# Altium project TEXAS.PrjPCB
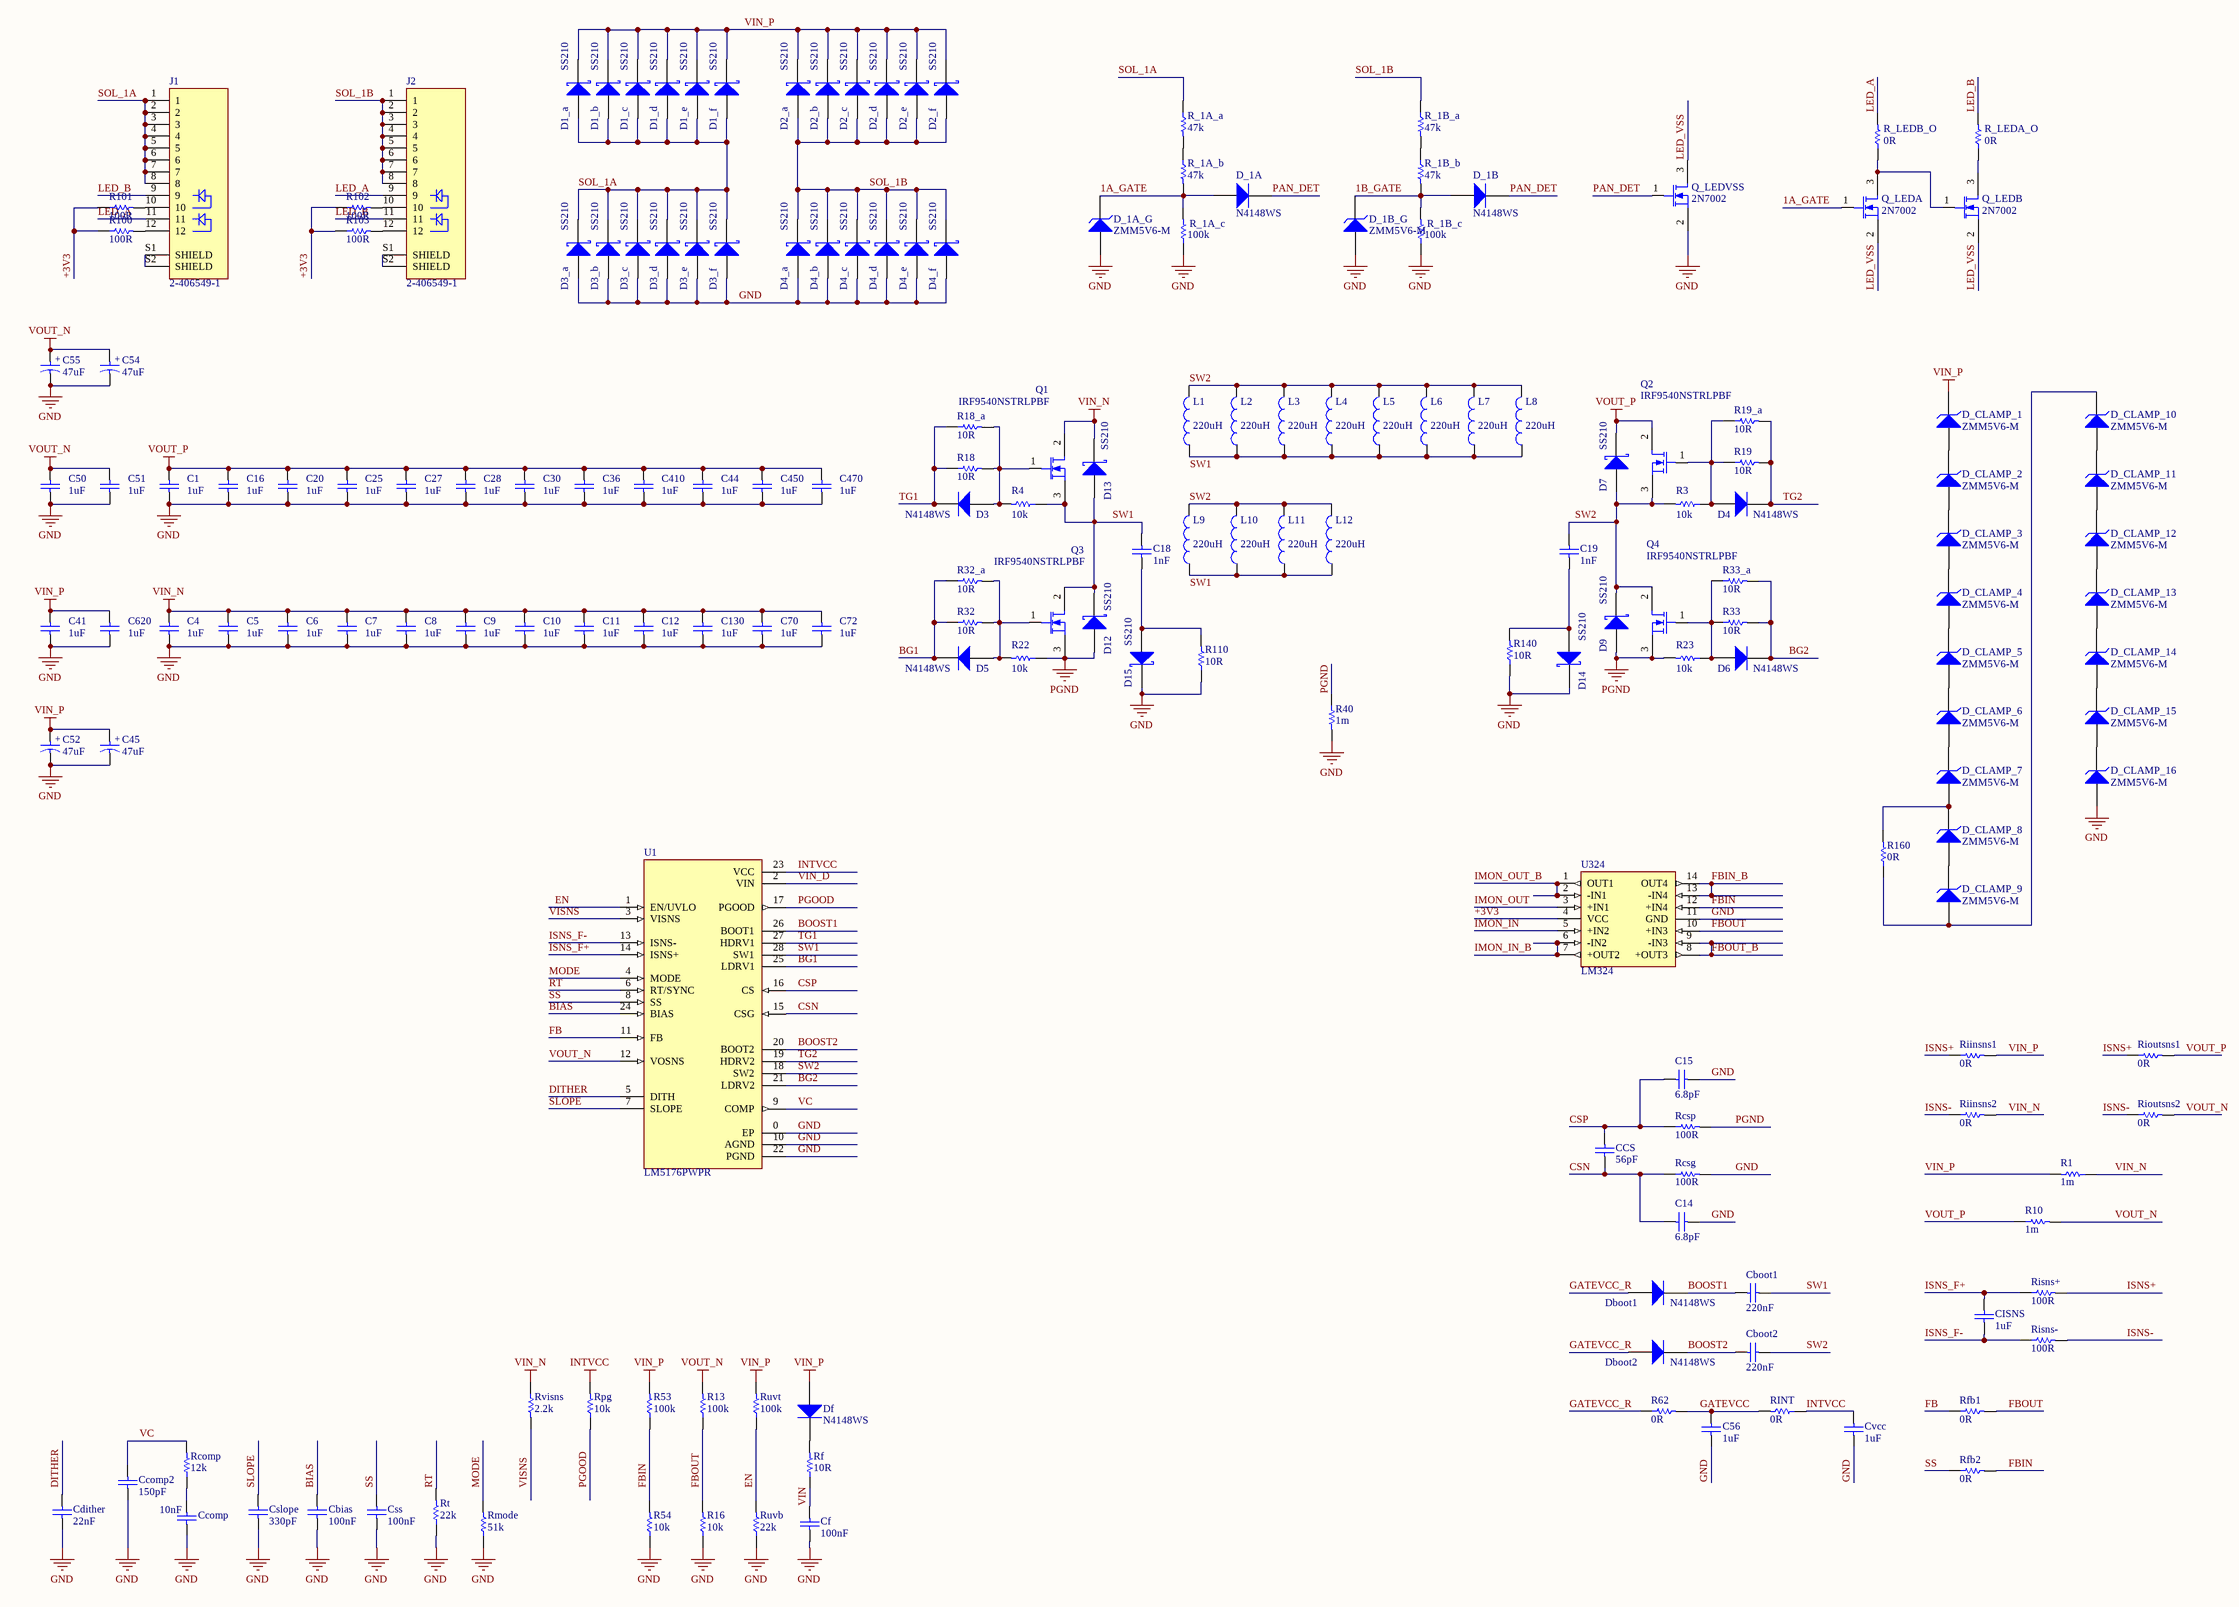
[diagram p0: SM3320-BATT-EV.SchDoc]
PCB_CopperRev: 001; PCB_MinorRev: -001 REV A; PCB_SilkRev: REV A; PRJ_BasePN: 600556; PRJ_Customer: National Semiconductor; PRJ_Title: SM3320-BATT-EV; SCH_Rev: X1; TechSupport: http://www.national.com/support
1 sheet, 183 parts. Net scope: global (net labels, ports and power ports of the same name join across sheets).
Board file: SM3320-BATT-EV.PcbDoc

## Sheet SM3320-BATT-EV.SchDoc: ChangeMe
size C; Date: Not shown in title block; ApprovedBy: Not shown in title block; CheckedBy: Not shown in title block; Author: Not shown in title block; CompanyName: Not shown in title block; DrawnBy: Not shown in title block; Engineer: Not shown in title block; Organization: Not shown in title block; Address1: Not shown in title block; Address2: Not shown in title block; Address3: Not shown in title block; Address4: Not shown in title block; DocumentNumber: 1; Revision: Use project parameter SCH_Rev; SheetNumber: 1; SheetTotal: 1; PageSetup: Record=PageOptions|CenterHorizontal=True|CenterVertical=True|PrintScale=0.85|XCorrection=0.00|YCorrection=0.00|PrintKind=2|BorderSize=5000000|LeftOffset=0|BottomOffset=0|Orientation=2|PaperLength=1000|PaperWidth=1000|Scale=100|PaperSource=15|PrintQuality=600|MediaType=1|DitherType=10|PaperKind=11x17|PrintScaleMode=0; CurrentTime: Not shown in title block; CurrentDate: Not shown in title block; Time: Not shown in title block; DocumentFullPathAndName: Not shown in title block; DocumentName: Not shown in title block; ModifiedDate: Not shown in title block; ImagePath: Not shown in title block

### Parts
C1  value 1uF  [C_1206]  (hidden comment: 1206B105K101NT)
C4  value 1uF  [C_1206]  (hidden comment: 1206B105K101NT)
C5  value 1uF  [C_1206]  (hidden comment: 1206B105K101NT)
C6  value 1uF  [C_1206]  (hidden comment: 1206B105K101NT)
C7  value 1uF  [C_1206]  (hidden comment: 1206B105K101NT)
C8  value 1uF  [C_1206]  (hidden comment: 1206B105K101NT)
C9  value 1uF  [C_1206]  (hidden comment: 1206B105K101NT)
C10  value 1uF  [C_1206]  (hidden comment: 1206B105K101NT)
C11  value 1uF  [C_1206]  (hidden comment: 1206B105K101NT)
C12  value 1uF  [C_1206]  (hidden comment: 1206B105K101NT)
C14  value 6.8pF  [C_0402]  (hidden comment: 0402CG6R8C500NT)
C15  value 6.8pF  [C_0402]  (hidden comment: 0402CG6R8C500NT)
C16  value 1uF  [C_1206]  (hidden comment: 1206B105K101NT)
C18  value 1nF  [C_1206]  (hidden comment: 1206B102K202NT)
C19  value 1nF  [C_1206]  (hidden comment: 1206B102K202NT)
C20  value 1uF  [C_1206]  (hidden comment: 1206B105K101NT)
C25  value 1uF  [C_1206]  (hidden comment: 1206B105K101NT)
C27  value 1uF  [C_1206]  (hidden comment: 1206B105K101NT)
C28  value 1uF  [C_1206]  (hidden comment: 1206B105K101NT)
C30  value 1uF  [C_1206]  (hidden comment: 1206B105K101NT)
C36  value 1uF  [C_1206]  (hidden comment: 1206B105K101NT)
C41  value 1uF  [C_1206]  (hidden comment: 1206B105K101NT)
C44  value 1uF  [C_1206]  (hidden comment: 1206B105K101NT)
C45  value 47uF  [C_CAN_1010]  (hidden comment: VZH470M2ATR-1010)
C50  value 1uF  [C_1206]  (hidden comment: 1206B105K101NT)
C51  value 1uF  [C_1206]  (hidden comment: 1206B105K101NT)
C52  value 47uF  [C_CAN_1010]  (hidden comment: VZH470M2ATR-1010)
C54  value 47uF  [C_CAN_1010]  (hidden comment: VZH470M2ATR-1010)
C55  value 47uF  [C_CAN_1010]  (hidden comment: VZH470M2ATR-1010)
C56  value 1uF  [C_0402]  (hidden comment: CL05A105KA5NQNC)
C70  value 1uF  [C_1206]  (hidden comment: 1206B105K101NT)
C72  value 1uF  [C_1206]  (hidden comment: 1206B105K101NT)
C130  value 1uF  [C_1206]  (hidden comment: 1206B105K101NT)
C410  value 1uF  [C_1206]  (hidden comment: 1206B105K101NT)
C450  value 1uF  [C_1206]  (hidden comment: 1206B105K101NT)
C470  value 1uF  [C_1206]  (hidden comment: 1206B105K101NT)
C620  value 1uF  [C_1206]  (hidden comment: 1206B105K101NT)
Cbias  value 100nF  [C_0603]  (hidden comment: CC0603KRX7R9BB104)
Cboot1  value 220nF  [C_0402]  (hidden comment: CL05B224KO5NNNC)
Cboot2  value 220nF  [C_0402]  (hidden comment: CL05B224KO5NNNC)
Ccomp  value 10nF  [C_0402]  (hidden comment: CL05B103KB5NNNC)
Ccomp2  value 150pF  [C_0402]  (hidden comment: 0402B151K500NT)
CCS  value 56pF  [C_0402]  (hidden comment: 0402CG560J500NT)
Cdither  value 22nF  [C_0402]  (hidden comment: 0402B223K500NT)
Cf  value 100nF  [C_0603]  (hidden comment: CC0603KRX7R9BB104)
CISNS  value 1uF  [C_0402]  (hidden comment: CL05A105KA5NQNC)
Cslope  value 330pF  [C_0603]  (hidden comment: CL10C331JB8NNNC)
Css  value 100nF  [C_0402]  (hidden comment: CL05B104KO5NNNC)
Cvcc  value 1uF  [C_0402]  (hidden comment: CL05A105KA5NQNC)
D1_a  SS210  [DO-214AC]
D1_b  SS210  [DO-214AC]
D1_c  SS210  [DO-214AC]
D1_d  SS210  [DO-214AC]
D1_e  SS210  [DO-214AC]
D1_f  SS210  [DO-214AC]
D2_a  SS210  [DO-214AC]
D2_b  SS210  [DO-214AC]
D2_c  SS210  [DO-214AC]
D2_d  SS210  [DO-214AC]
D2_e  SS210  [DO-214AC]
D2_f  SS210  [DO-214AC]
D3  N4148WS  [SOD-323]
D3_a  SS210  [DO-214AC]
D3_b  SS210  [DO-214AC]
D3_c  SS210  [DO-214AC]
D3_d  SS210  [DO-214AC]
D3_e  SS210  [DO-214AC]
D3_f  SS210  [DO-214AC]
D4  N4148WS  [SOD-323]
D4_a  SS210  [DO-214AC]
D4_b  SS210  [DO-214AC]
D4_c  SS210  [DO-214AC]
D4_d  SS210  [DO-214AC]
D4_e  SS210  [DO-214AC]
D4_f  SS210  [DO-214AC]
D5  N4148WS  [SOD-323]
D6  N4148WS  [SOD-323]
D7  SS210  [DO-214AC]
D9  SS210  [DO-214AC]
D12  SS210  [DO-214AC]
D13  SS210  [DO-214AC]
D14  SS210  [DO-214AC]
D15  SS210  [DO-214AC]
D_1A  N4148WS  [SOD-323]
D_1A_G  ZMM5V6-M  [DO-213AA]
D_1B  N4148WS  [SOD-323]
D_1B_G  ZMM5V6-M  [DO-213AA]
D_CLAMP_1  ZMM5V6-M  [DO-213AA]
D_CLAMP_2  ZMM5V6-M  [DO-213AA]
D_CLAMP_3  ZMM5V6-M  [DO-213AA]
D_CLAMP_4  ZMM5V6-M  [DO-213AA]
D_CLAMP_5  ZMM5V6-M  [DO-213AA]
D_CLAMP_6  ZMM5V6-M  [DO-213AA]
D_CLAMP_7  ZMM5V6-M  [DO-213AA]
D_CLAMP_8  ZMM5V6-M  [DO-213AA]
D_CLAMP_9  ZMM5V6-M  [DO-213AA]
D_CLAMP_10  ZMM5V6-M  [DO-213AA]
D_CLAMP_11  ZMM5V6-M  [DO-213AA]
D_CLAMP_12  ZMM5V6-M  [DO-213AA]
D_CLAMP_13  ZMM5V6-M  [DO-213AA]
D_CLAMP_14  ZMM5V6-M  [DO-213AA]
D_CLAMP_15  ZMM5V6-M  [DO-213AA]
D_CLAMP_16  ZMM5V6-M  [DO-213AA]
Dboot1  N4148WS  [SOD-323]
Dboot2  N4148WS  [SOD-323]
Df  N4148WS  [SOD-323]
J1  2-406549-1  [TE_2-406549-1]
J2  2-406549-1  [TE_2-406549-1]
L1  value 220uH  [SRR1260]  (hidden comment: SWRB1207S-221MT)
L2  value 220uH  [SRR1260]  (hidden comment: SWRB1207S-221MT)
L3  value 220uH  [SRR1260]  (hidden comment: SWRB1207S-221MT)
L4  value 220uH  [SRR1260]  (hidden comment: SWRB1207S-221MT)
L5  value 220uH  [SRR1260]  (hidden comment: SWRB1207S-221MT)
L6  value 220uH  [SRR1260]  (hidden comment: SWRB1207S-221MT)
L7  value 220uH  [SRR1260]  (hidden comment: SWRB1207S-221MT)
L8  value 220uH  [SRR1260]  (hidden comment: SWRB1207S-221MT)
L9  value 220uH  [SRR1260]  (hidden comment: SWRB1207S-221MT)
L10  value 220uH  [SRR1260]  (hidden comment: SWRB1207S-221MT)
L11  value 220uH  [SRR1260]  (hidden comment: SWRB1207S-221MT)
L12  value 220uH  [SRR1260]  (hidden comment: SWRB1207S-221MT)
Q1  IRF9540NSTRLPBF  [TO-263-3]
Q2  IRF9540NSTRLPBF  [TO-263-3]
Q3  IRF9540NSTRLPBF  [TO-263-3]
Q4  IRF9540NSTRLPBF  [TO-263-3]
Q_LEDA  2N7002  [TO-236AB]
Q_LEDB  2N7002  [TO-236AB]
Q_LEDVSS  2N7002  [TO-236AB]
R1  1m  [R_2512]
R3  value 10k  [R_0402]  (hidden comment: 0402WGF1002TCE)
R4  value 10k  [R_0402]  (hidden comment: 0402WGF1002TCE)
R10  1m  [R_2512]
R13  value 100k  [R_0603]  (hidden comment: 0603WAF100KT5E)
R16  value 10k  [R_0603]  (hidden comment: 0603WAF1002T5E)
R18  value 10R  [R_0402]  (hidden comment: 0402WGF100JTCE)
R18_a  value 10R  [R_0402]  (hidden comment: 0402WGF100JTCE)
R19  value 10R  [R_0402]  (hidden comment: 0402WGF100JTCE)
R19_a  value 10R  [R_0402]  (hidden comment: 0402WGF100JTCE)
R22  value 10k  [R_0402]  (hidden comment: 0402WGF1002TCE)
R23  value 10k  [R_0402]  (hidden comment: 0402WGF1002TCE)
R32  value 10R  [R_0402]  (hidden comment: 0402WGF100JTCE)
R32_a  value 10R  [R_0402]  (hidden comment: 0402WGF100JTCE)
R33  value 10R  [R_0402]  (hidden comment: 0402WGF100JTCE)
R33_a  value 10R  [R_0402]  (hidden comment: 0402WGF100JTCE)
R40  1m  [R_2512]
R53  value 100k  [R_0603]  (hidden comment: 0603WAF100KT5E)
R54  value 10k  [R_0603]  (hidden comment: 0603WAF1002T5E)
R62  value 0R  [R_0402]  (hidden comment: 0402WGF0000TCE)
R100  value 100R  [R_0402]  (hidden comment: 0402WGF1000TCE)
R101  value 100R  [R_0402]  (hidden comment: 0402WGF1000TCE)
R102  value 100R  [R_0402]  (hidden comment: 0402WGF1000TCE)
R103  value 100R  [R_0402]  (hidden comment: 0402WGF1000TCE)
R110  value 10R  [R_1206]  (hidden comment: 1206W4F100JT5E)
R140  value 10R  [R_1206]  (hidden comment: 1206W4F100JT5E)
R160  value 0R  [R_0402]  (hidden comment: 0402WGF0000TCE)
R_1A_a  value 47k  [R_0402]  (hidden comment: 0402WGF4702TCE)
R_1A_b  value 47k  [R_0402]  (hidden comment: 0402WGF4702TCE)
R_1A_c  value 100k  [R_0402]  (hidden comment: 0402WGF1003TCE)
R_1B_a  value 47k  [R_0402]  (hidden comment: 0402WGF4702TCE)
R_1B_b  value 47k  [R_0402]  (hidden comment: 0402WGF4702TCE)
R_1B_c  value 100k  [R_0402]  (hidden comment: 0402WGF1003TCE)
R_LEDA_O  value 0R  [R_0402]  (hidden comment: 0402WGF0000TCE)
R_LEDB_O  value 0R  [R_0402]  (hidden comment: 0402WGF0000TCE)
Rcomp  value 12k  [R_0402]  (hidden comment: 0402WGF1202TCE)
Rcsg  value 100R  [R_0402]  (hidden comment: 0402WGF1000TCE)
Rcsp  value 100R  [R_0402]  (hidden comment: 0402WGF1000TCE)
Rf  value 10R  [R_0402]  (hidden comment: 0402WGF100JTCE)
Rfb1  value 0R  [R_0402]  (hidden comment: 0402WGF0000TCE)
Rfb2  value 0R  [R_0402]  (hidden comment: 0402WGF0000TCE)
Riinsns1  value 0R  [R_0402]  (hidden comment: 0402WGF0000TCE)
Riinsns2  value 0R  [R_0402]  (hidden comment: 0402WGF0000TCE)
RINT  value 0R  [R_0402]  (hidden comment: 0402WGF0000TCE)
Rioutsns1  value 0R  [R_0402]  (hidden comment: 0402WGF0000TCE)
Rioutsns2  value 0R  [R_0402]  (hidden comment: 0402WGF0000TCE)
Risns+  value 100R  [R_0402]  (hidden comment: 0402WGF1000TCE)
Risns-  value 100R  [R_0402]  (hidden comment: 0402WGF1000TCE)
Rmode  value 51k  [R_0402]  (hidden comment: 0402WGF5102TCE)
Rpg  value 10k  [R_0402]  (hidden comment: 0402WGF1002TCE)
Rt  value 22k  [R_0402]  (hidden comment: 0402WGF2202TCE)
Ruvb  value 22k  [R_0402]  (hidden comment: 0402WGF2202TCE)
Ruvt  value 100k  [R_0603]  (hidden comment: 0603WAF100KT5E)
Rvisns  value 2.2k  [R_0402]  (hidden comment: 0402WGF2201TCE)
U1  LM5176PWPR  [TSSOP-28-EP-P0.65MM-W4.4MM]
U324  LM324  [SOIC-14-P1.27-W3.5]

### Nets
GND: C1.1 C4.1 C5.1 C6.1 C7.1 C8.1 C9.1 C10.1 C11.1 C12.1 C14.2 C15.2 C16.1 C20.1 C25.1 C27.1 C28.1 C30.1 C36.1 C41.1 C44.1 C45.1 C50.1 C51.1 C52.1 C54.1 C55.1 C56.1 C70.1 C72.1 C130.1 C410.1 C450.1 C470.1 C620.1 Cbias.1 Ccomp.1 Ccomp2.1 Cdither.1 Cf.1 Cslope.1 Css.1 Cvcc.1 D3_a.2(A) D3_b.2(A) D3_c.2(A) D3_d.2(A) D3_e.2(A) D3_f.2(A) D4_a.2(A) D4_b.2(A) D4_c.2(A) D4_d.2(A) D4_e.2(A) D4_f.2(A) D14.1(K) D15.1(K) D_1A_G.2(A) D_1B_G.2(A) D_CLAMP_16.2(A) Q_LEDVSS.2(S) R16.1 R40.2 R54.1 R110.1 R140.1 R_1A_c.1 R_1B_c.1 Rcsg.2 Rmode.1 Rt.1 Ruvb.1 U1.0(EP) U1.10(AGND) U1.22(PGND) U324.11(GND)
INTVCC: Cvcc.2 RINT.1 Rpg.2 U1.23(VCC)
PGND: D9.2(A) D12.2(A) Q3.3(S) Q4.3(S) R22.1 R23.2 R40.1 Rcsp.2
VIN_N: C4.2 C5.2 C6.2 C7.2 C8.2 C9.2 C10.2 C11.2 C12.2 C70.2 C72.2 C130.2 D13.1(K) Q1.2(D) R1.1 Riinsns2.2 Rvisns.1
VIN_P: C41.2 C45.2 C52.2 C620.2 D1_a.1(K) D1_b.1(K) D1_c.1(K) D1_d.1(K) D1_e.1(K) D1_f.1(K) D2_a.1(K) D2_b.1(K) D2_c.1(K) D2_d.1(K) D2_e.1(K) D2_f.1(K) D_CLAMP_1.1(K) Df.2(A) R1.2 R53.2 Riinsns1.2 Ruvt.2
VOUT_N: C50.2 C51.2 C54.2 C55.2 R10.2 R13.2 Rioutsns2.2 U1.12(VOSNS)
VOUT_P: C1.2 C16.2 C20.2 C25.2 C27.2 C28.2 C30.2 C36.2 C44.2 C410.2 C450.2 C470.2 D7.1(K) Q2.2(D) R10.1 Rioutsns1.2
1A_GATE: D_1A.2(A) D_1A_G.1(K) Q_LEDA.1(G) R_1A_b.2 R_1A_c.2
1B_GATE: D_1B.2(A) D_1B_G.1(K) R_1B_b.2 R_1B_c.2
+3V3: R100.1 R101.1 R102.1 R103.1 U324.4(VCC)
BG1: D5.1(K) R32.1 R32_a.1 U1.25(LDRV1)
BG2: D6.1(K) R33.2 R33_a.2 U1.21(LDRV2)
BIAS: Cbias.2 U1.24(BIAS)
BOOST1: Cboot1.2 Dboot1.1(K) U1.26(BOOT1)
BOOST2: Cboot2.2 Dboot2.1(K) U1.20(BOOT2)
CSN: C14.1 CCS.1 Rcsg.1 U1.15(CSG)
CSP: C15.1 CCS.2 Rcsp.1 U1.16(CS)
DITHER: Cdither.2 U1.5(DITH)
EN: Ruvb.2 Ruvt.1 U1.1(EN/UVLO)
FB: Rfb1.1 U1.11(FB)
FBIN: R53.1 R54.2 Rfb2.2 U324.12(+IN4)
FBIN_B: U324.13(-IN4) U324.14(OUT4)
FBOUT: R13.1 R16.2 Rfb1.2 U324.10(+IN3)
FBOUT_B: U324.8(+OUT3) U324.9(-IN3)
GATEVCC: C56.2 R62.2 RINT.2
GATEVCC_R: Dboot1.2(A) Dboot2.2(A) R62.1
IMON_IN: U324.5(+IN2)
IMON_IN_B: U324.6(-IN2) U324.7(+OUT2)
IMON_OUT: U324.3(+IN1)
IMON_OUT_B: U324.1(OUT1) U324.2(-IN1)
ISNS+: Riinsns1.1 Rioutsns1.1 Risns+.2
ISNS-: Riinsns2.1 Rioutsns2.1 Risns-.2
ISNS_F+: CISNS.2 Risns+.1 U1.14(ISNS+)
ISNS_F-: CISNS.1 Risns-.1 U1.13(ISNS-)
LED_A: J1.11 J2.9 R_LEDB_O.2
LED_B: J1.9 J2.11 R_LEDA_O.2
LED_VSS: Q_LEDA.2(S) Q_LEDB.2(S) Q_LEDVSS.3(D)
MODE: Rmode.2 U1.4(MODE)
PAN_DET: D_1A.1(K) D_1B.1(K) Q_LEDVSS.1(G)
PGOOD: Rpg.1 U1.17(PGOOD)
RT: Rt.2 U1.6(RT/SYNC)
SLOPE: Cslope.2 U1.7(SLOPE)
SOL_1A: D1_a.2(A) D1_b.2(A) D1_c.2(A) D1_d.2(A) D1_e.2(A) D1_f.2(A) D3_a.1(K) D3_b.1(K) D3_c.1(K) D3_d.1(K) D3_e.1(K) D3_f.1(K) J1.1 J1.2 J1.3 J1.4 J1.5 J1.6 J1.7 J1.8 R_1A_a.1
SOL_1B: D2_a.2(A) D2_b.2(A) D2_c.2(A) D2_d.2(A) D2_e.2(A) D2_f.2(A) D4_a.1(K) D4_b.1(K) D4_c.1(K) D4_d.1(K) D4_e.1(K) D4_f.1(K) J2.1 J2.2 J2.3 J2.4 J2.5 J2.6 J2.7 J2.8 R_1B_a.1
SS: Css.2 Rfb2.1 U1.8(SS)
SW1: C18.2 Cboot1.1 D12.1(K) D13.2(A) L1.1 L2.1 L3.1 L4.1 L5.1 L6.1 L7.1 L8.1 L9.1 L10.1 L11.1 L12.1 Q1.3(S) Q3.2(D) R4.1 U1.28(SW1)
SW2: C19.2 Cboot2.1 D7.2(A) D9.1(K) L1.2 L2.2 L3.2 L4.2 L5.2 L6.2 L7.2 L8.2 L9.2 L10.2 L11.2 L12.2 Q2.3(S) Q4.2(D) R3.2 U1.18(SW2)
TG1: D3.1(K) R18.1 R18_a.1 U1.27(HDRV1)
TG2: D4.1(K) R19.2 R19_a.2 U1.19(HDRV2)
VC: Ccomp2.2 Rcomp.2 U1.9(COMP)
VIN: Cf.2 Rf.1
VIN_D: U1.2(VIN)
VISNS: Rvisns.2 U1.3(VISNS)
NetC18_1: C18.1 D15.2(A) R110.2
NetC19_1: C19.1 D14.2(A) R140.2
NetCcomp_2: Ccomp.2 Rcomp.1
NetD3_2: D3.2(A) Q1.1(G) R4.2 R18.2 R18_a.2
NetD4_2: D4.2(A) Q2.1(G) R3.1 R19.1 R19_a.1
NetD5_2: D5.2(A) Q3.1(G) R22.2 R32.2 R32_a.2
NetD6_2: D6.2(A) Q4.1(G) R23.1 R33.1 R33_a.1
NetD_CLAMP_1_2: D_CLAMP_1.2(A) D_CLAMP_2.1(K)
NetD_CLAMP_2_2: D_CLAMP_2.2(A) D_CLAMP_3.1(K)
NetD_CLAMP_3_2: D_CLAMP_3.2(A) D_CLAMP_4.1(K)
NetD_CLAMP_4_2: D_CLAMP_4.2(A) D_CLAMP_5.1(K)
NetD_CLAMP_5_2: D_CLAMP_5.2(A) D_CLAMP_6.1(K)
NetD_CLAMP_6_2: D_CLAMP_6.2(A) D_CLAMP_7.1(K)
NetD_CLAMP_7_2: D_CLAMP_7.2(A) D_CLAMP_8.1(K) R160.2
NetD_CLAMP_8_2: D_CLAMP_8.2(A) D_CLAMP_9.1(K)
NetD_CLAMP_9_2: D_CLAMP_9.2(A) D_CLAMP_10.1(K) R160.1
NetD_CLAMP_10_2: D_CLAMP_10.2(A) D_CLAMP_11.1(K)
NetD_CLAMP_11_2: D_CLAMP_11.2(A) D_CLAMP_12.1(K)
NetD_CLAMP_12_2: D_CLAMP_12.2(A) D_CLAMP_13.1(K)
NetD_CLAMP_13_2: D_CLAMP_13.2(A) D_CLAMP_14.1(K)
NetD_CLAMP_14_2: D_CLAMP_14.2(A) D_CLAMP_15.1(K)
NetD_CLAMP_15_2: D_CLAMP_15.2(A) D_CLAMP_16.1(K)
NetDf_1: Df.1(K) Rf.2
NetJ1_10: J1.10 R101.2
NetJ1_12: J1.12 R100.2
NetJ1_S1: J1.S1(SHIELD) J1.S2(SHIELD)
NetJ2_10: J2.10 R102.2
NetJ2_12: J2.12 R103.2
NetJ2_S1: J2.S1(SHIELD) J2.S2(SHIELD)
NetQ_LEDA_3: Q_LEDA.3(D) Q_LEDB.1(G) R_LEDB_O.1
NetQ_LEDB_3: Q_LEDB.3(D) R_LEDA_O.1
NetR_1A_a_2: R_1A_a.2 R_1A_b.1
NetR_1B_a_2: R_1B_a.2 R_1B_b.1

### Notes on the sheet
- Title
- Size:
- Date:
- File:
- C
- Number:
- Time:
- Revision:
- Sheet
- of
- (in symbol VZH470M2ATR-1010) +

### Library data of the parts
C1 C4-C12 C16 C20 C25 C27 C28 C30 C36 C41 C44 C50 C51 C70 C72 C130 C410 C450 C470 C620 = 1206B105K101NT: C - CAPACITOR - MLCC - 1uF - 100V - 1206 - X7R; WVDC: 100; LCSC Part #: C91151; JLC Availability: Extended
C14 C15 = 0402CG6R8C500NT: C - CAPACITOR - MLCC - 6.8pF - 50V - 0402; WVDC: 50; LCSC Part #: C1576; JLC Availability: Basic
C18 C19 = 1206B102K202NT: C - CAPACITOR - MLCC - 1nF - 2000V - 1206 - X7R; WVDC: 2000; LCSC Part #: C9196; JLC Availability: Basic
C45 C52 C54 C55 = VZH470M2ATR-1010: C - CAPACITOR - ELECTROLYTIC - 47uF - 100V; WVDC: 100; ESR: 40mOhm; LCSC Part #: C164068; JLC Availability: Extended
C56 CISNS Cvcc = CL05A105KA5NQNC: C - CAPACITOR - MLCC - 1uF - 25V - 0402; WVDC: 16; LCSC Part #: C52923; JLC Availability: Basic
Cbias Cf = CC0603KRX7R9BB104: C - CAPACITOR - MLCC - 100nF - 50V - 0603; WVDC: 50; LCSC Part #: C14663; JLC Availability: Basic
Cboot1 Cboot2 = CL05B224KO5NNNC: C - CAPACITOR - MLCC - 220nF - 16V - 0402; WVDC: 16; LCSC Part #: C16772; JLC Availability: Basic
Ccomp = CL05B103KB5NNNC: C - CAPACITOR - MLCC - 10nF - 50V - 0402; WVDC: 50; LCSC Part #: C15195; JLC Availability: Basic
Ccomp2 = 0402B151K500NT: C - CAPACITOR - MLCC - 150pF - 50V - 0402; WVDC: 50; LCSC Part #: C1527; JLC Availability: Basic
CCS = 0402CG560J500NT: C - CAPACITOR - MLCC - 56pF - 50V -  0402; WVDC: 50; LCSC Part #: C1572; JLC Availability: Basic
Cdither = 0402B223K500NT: C - CAPACITOR - MLCC - 22nF - 50V - 0402; WVDC: 50; LCSC Part #: C1532; JLC Availability: Basic
Cslope = CL10C331JB8NNNC: C - CAPACITOR - MLCC - 330pF - 50V - 0603; WVDC: 50; LCSC Part #: C1664; JLC Availability: Basic
Css = CL05B104KO5NNNC: C - CAPACITOR - MLCC - 100nF - 16V - 0402; WVDC: 16; LCSC Part #: C1525; JLC Availability: Basic
D1_a D1_b D1_c D1_d D1_e D1_f D2_a D2_b D2_c D2_d D2_e D2_f D3_a D3_b D3_c D3_d D3_e D3_f D4_a D4_b D4_c D4_d D4_e D4_f D7 D9 D12-D15 = SS210: D - DIODE - SCHOTTKY - 100V - 2A; Vrrm: 100; If: 2A; LCSC Part #: C14996; JLC Availability: Extended
D3-D6 D_1A D_1B Dboot1 Dboot2 Df = N4148WS: D - DIODE - FAST TRR - 100V - 150mA - 4ns; LCSC Part #: C2128; JLC Availability: Basic; PIV: 100V; If: 150mA; Trr: 4ns
D_1A_G D_1B_G D_CLAMP_1-D_CLAMP_16 = ZMM5V6-M: D - DIODE - ZENER - 5.6V - 500mW; LCSC Part #: C8062; JLC Availability: BASIC
J1 J2 = 2-406549-1: J - JACK - ETHERNET - Right - THT; LCSC Part #: C125068; JLC Availability: Extended
L1-L12 = SWRB1207S-221MT: L - INDUCTOR - 220uH - 1.6A - 12.5mm; Isat: 1.6A; LCSC Part #: C169380; JLC Availability: Extended
Q1-Q4 = IRF9540NSTRLPBF: Q - TRANSISTOR - MOSFET (N) - 250V - 33A - 0.094R; WVDC: 100; LCSC Part #: C33903; JLC Availability: Extended
Q_LEDA Q_LEDB Q_LEDVSS = 2N7002: Q - TRANSISTOR - MOSFET (N) - 60V - 200mW; WVDC: 60; JLC Availability: Basic; LCSC Part #: C8545
R1 R10 R40 = EWSL2512F1L00S9: R - RESISTOR - SMD - 0.001R - 1% - 2512 - 2W - 50ppm/k; LCSC Part #: C349153; JLC Availability: Extended; ComponentLink1URL: http://riedon.com/media/pdf/CSR.pdf; ComponentLink1Description: http://riedon.com/media/pdf/CSR.pdf; Power: 2W
R3 R4 R22 R23 Rpg = 0402WGF1002TCE: R - RESISTOR - SMD - 10k - 1% - 0402; LCSC Part #: C25744; JLC Availability: Basic
R13 R53 Ruvt = 0603WAF100KT5E: R - RESISTOR - SMD - 100k - 1% -  0603; LCSC Part #: C22936; JLC Availability: Basic
R16 R54 = 0603WAF1002T5E: R - RESISTOR - SMD - 10k - 1% - 0603; LCSC Part #: C25804; JLC Availability: Basic
R18 R18_a R19 R19_a R32 R32_a R33 R33_a Rf = 0402WGF100JTCE: R - RESISTOR - SMD - 10R - 1% - 0402; LCSC Part #: C25077; JLC Availability: Basic
R62 R160 R_LEDA_O R_LEDB_O Rfb1 Rfb2 Riinsns1 Riinsns2 RINT Rioutsns1 Rioutsns2 = 0402WGF0000TCE: R - RESISTOR - SMD - 0R - 1% - 0402; LCSC Part #: C17168; JLC Availability: Basic
R100-R103 Rcsg Rcsp Risns+ Risns- = 0402WGF1000TCE: R - RESISTOR - SMD - 100R - 1% - 0402; LCSC Part #: C25076; JLC Availability: Basic
R110 R140 = 1206W4F100JT5E: R - RESISTOR - SMD - 10R - 1% - 1206; LCSC Part #: C17903; JLC Availability: Basic
R_1A_a R_1A_b R_1B_a R_1B_b = 0402WGF4702TCE: R - RESISTOR - SMD - 47k - 1% - 0402; LCSC Part #: C25792; JLC Availability: Basic
R_1A_c R_1B_c = 0402WGF1003TCE: R - RESISTOR - SMD - 100k - 1% -  0402; LCSC Part #: C25741; JLC Availability: Basic
Rcomp = 0402WGF1202TCE: R - RESISTOR - SMD - 12k - 1% - 0402; LCSC Part #: C25752; JLC Availability: Basic
Rmode = 0402WGF5102TCE: R - RESISTOR - SMD - 51k - 1% - 0402; LCSC Part #: C25794; JLC Availability: Basic
Rt Ruvb = 0402WGF2202TCE: R - RESISTOR - SMD - 22k - 1% - 0402; LCSC Part #: C25768; JLC Availability: Basic
Rvisns = 0402WGF2201TCE: R - RESISTOR - SMD - 2.2k - 1% - 0402; LCSC Part #: C25879; JLC Availability: Basic
U1 = LM5176PWPR: U - IC - 55-V wide VIN synchronous 4-switch buck-boost controller 28-HTSSOP -40 to 125; MP: LM5176QPWPR; LCSC Part #: C442493; Price: None; Value: *; Availability: Extended; Package: None
U324 = LM324DT: U - IC - OP AMP (QUAD); Speed: 0.4V/us; LCSC Part #: C71035; JLC Availability: Basic

## Assembly variants
CS_OUT: not fitted Rfb2 Riinsns1 Riinsns2